# EAGLE design Mi2_v2 (EAGLE 7.2.0)
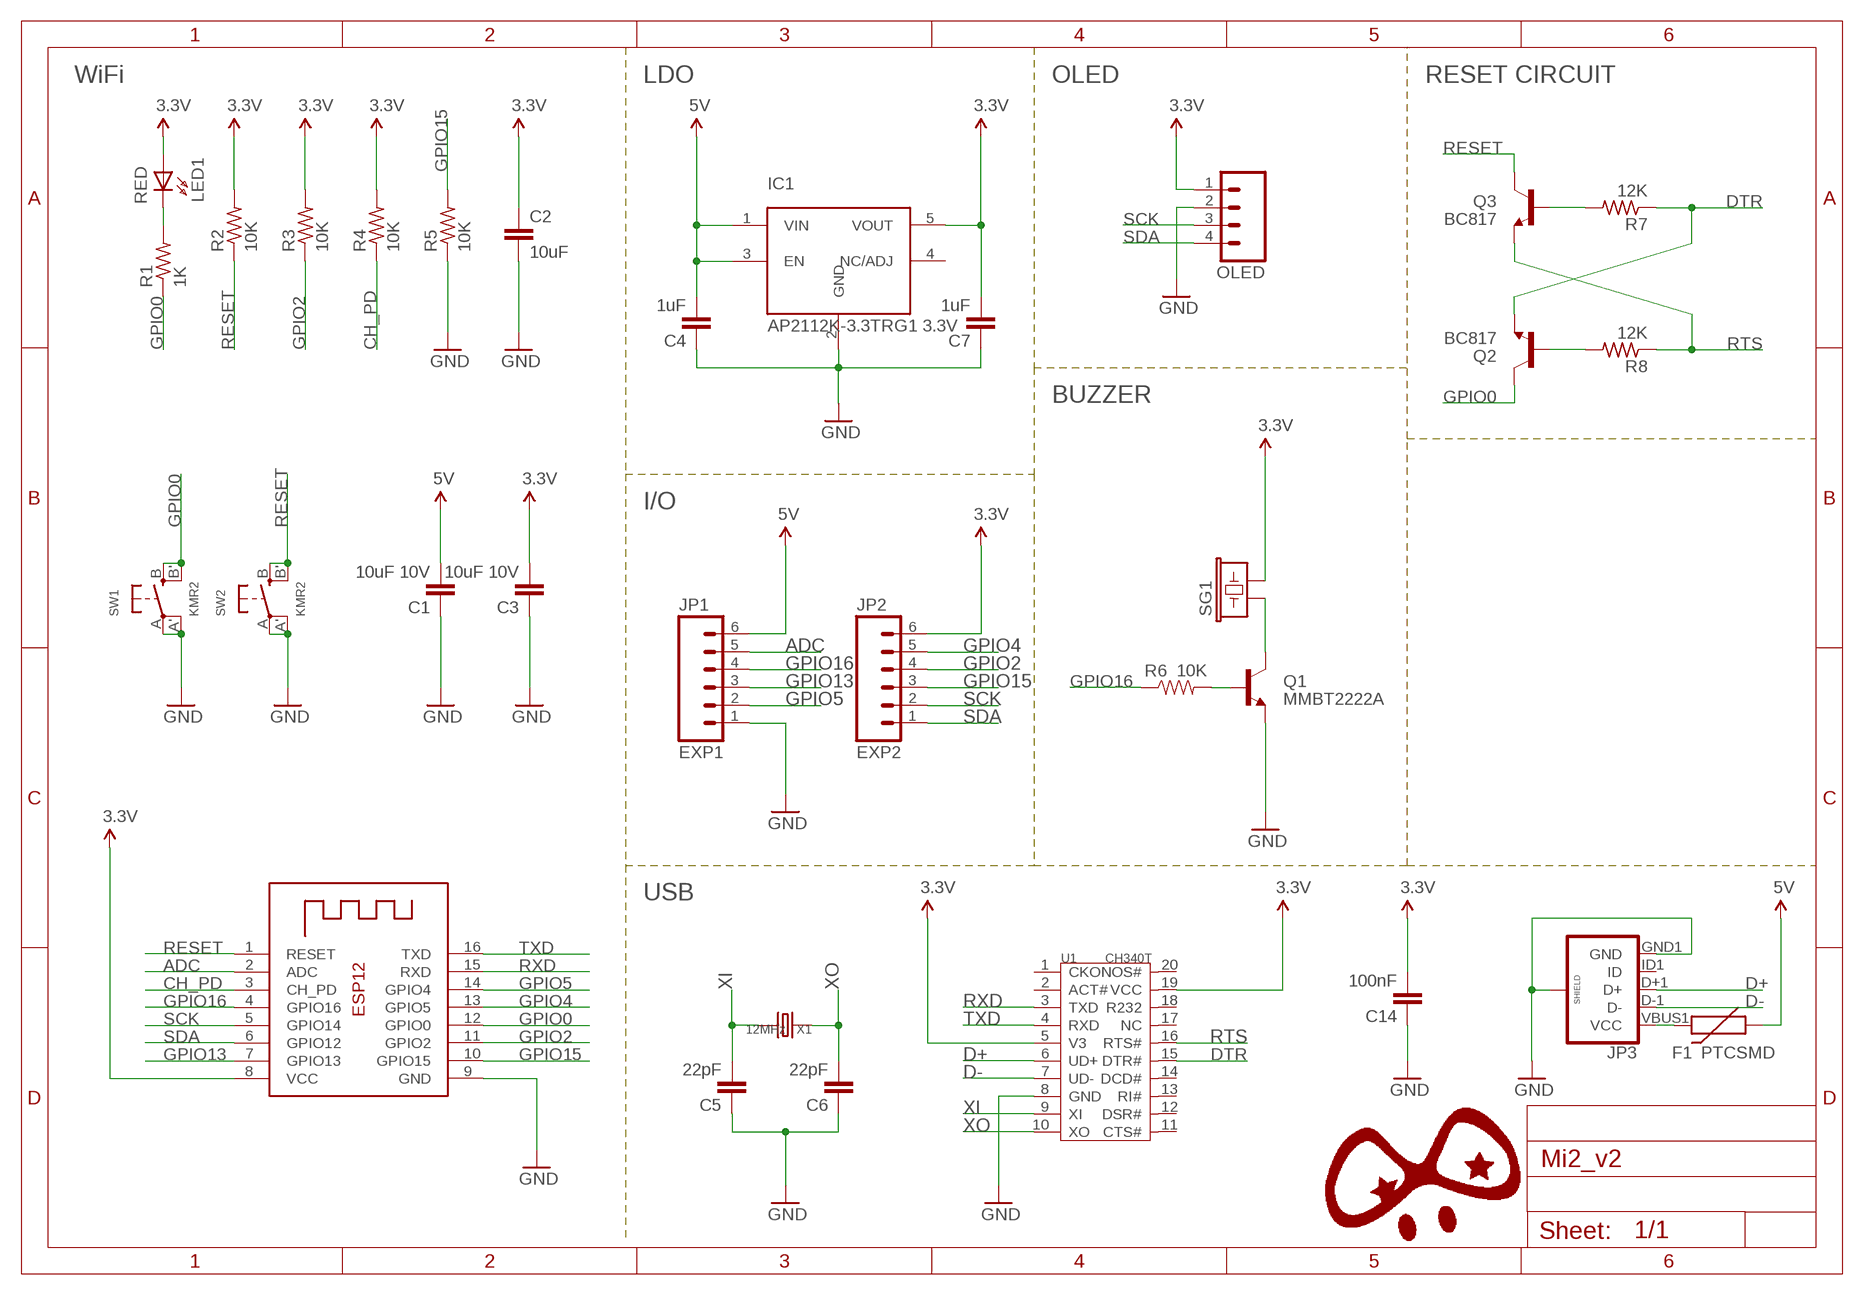
[diagram p0: schematic, sheet 1]

## Parts
C1  10uF 10V  CAP0402-CAP  [0402-CAP]
C2  10uF  10UF-6.3V-20%(0603)  [0603-CAP]
C3  10uF 10V  CAP0402-CAP  [0402-CAP]
C4  1uF  CAP0402-CAP  [0402-CAP]
C5  22pF  CAP0402-CAP  [0402-CAP]
C6  22pF  CAP0402-CAP  [0402-CAP]
C7  1uF  CAP0402-CAP  [0402-CAP]
C14  100nF  CAP0402-CAP  [0402-CAP]
F1  PTCSMD  [PTC-1206]
IC1  AP2112K-3.3TRG1 3.3V  5PIN_REG  [SOT23-5]
JP1  EXP1  M06LOCK  [1X06_LOCK]
JP2  EXP2  M06LOCK  [1X06_LOCK]
JP3  USB_MICROB_PLUGCONN-11752  [USB-B-MICRO-SMD_V03]
LED1  RED  LED0603DWS_L  [LED-0603_L]
OLED  M04LOCK  [1X04_LOCK]
Q1  MMBT2222A  TRANSISTOR_NPNMMBT2222A  [SOT23-3]
Q2  BC817  TRANSISTOR_NPNMMBT2222A  [SOT23-3]
Q3  BC817  TRANSISTOR_NPNMMBT2222A  [SOT23-3]
R1  1K  R-US_R0402  [R0402]
R2  10K  R-US_R0402  [R0402]
R3  10K  R-US_R0402  [R0402]
R4  10K  R-US_R0402  [R0402]
R5  10K  R-US_R0402  [R0402]
R6  10K  RESISTOR0402-RES  [0402-RES]
R7  12K  R-US_R0402  [R0402]
R8  12K  R-US_R0402  [R0402]
SG1  BUZZERSMD2  [BUZZER-CCV]
SW1  KMR2  SWITCH_TACT_SMT4.6X2.8  [BTN_KMR2_4.6X2.8]
SW2  KMR2  SWITCH_TACT_SMT4.6X2.8  [BTN_KMR2_4.6X2.8]
U1  CH340T  [SSOP20]
X1  12MHz  CRYSTAL'5032'  [2P-SMD-5X3.2]
X2  ESP-12  [ESP-12]

## Nets
3.3V: C2.1 C3.2 C7.2 C14.2 IC1.5(VOUT) JP2.6 LED1.A OLED.1 R2.2 R3.2 R4.2 SG1.- U1.5(V3) U1.19(VCC) X2.8(VCC)
5V: C1.2 C4.2 F1.1 IC1.1(VIN) IC1.3(EN) JP1.6
ADC: JP1.5 X2.2(ADC)
CH_PD: R4.1 X2.3(CH_PD)
D+: JP3.D+1(D+) U1.6(UD+)
D-: JP3.D-1(D-) U1.7(UD-)
DTR: Q2.2(E) R7.1 U1.15(DTR#)
GND: C1.1 C2.2 C3.1 C4.1 C5.1 C6.1 C7.1 C14.1 IC1.2(GND) JP1.1 JP3.GND1(GND) JP3.SHIELD1(SHIELD) JP3.SHIELD2(SHIELD) JP3.SHIELD3(SHIELD) OLED.2 Q1.2(E) R5.1 SW1.A'(P1) SW1.A(P) SW2.A'(P1) SW2.A(P) U1.8(GND) X2.9(GND)
GPIO0: Q2.3(C) R1.1 SW1.B'(S1) SW1.B(S) X2.12(GPIO0)
GPIO2: JP2.4 R3.1 X2.11(GPIO2)
GPIO4: JP2.5 X2.13(GPIO5)
GPIO5: JP1.2 X2.14(GPIO4)
GPIO13: JP1.3 X2.7(GPIO13)
GPIO15: JP2.3 R5.2 X2.10(GPIO15)
GPIO16: JP1.4 R6.1 X2.4(GPIO16)
N$1: Q3.1(B) R7.2
N$2: LED1.C R1.2
N$3: Q2.1(B) R8.2
N$7: Q1.3(C) SG1.+
N$8: Q1.1(B) R6.2
N$14: F1.2 JP3.VBUS1(VCC)
RESET: Q3.3(C) R2.1 SW2.B'(S1) SW2.B(S) X2.1(RESET)
RTS: Q3.2(E) R8.1 U1.16(RTS#)
RXD: U1.3(TXD) X2.15(RXD)
SCK: JP2.2 OLED.3 X2.5(GPIO14)
SDA: JP2.1 OLED.4 X2.6(GPIO12)
TXD: U1.4(RXD) X2.16(TXD)
XI: C5.2 U1.9(XI) X1.2
XO: C6.2 U1.10(XO) X1.1
Unconnected: IC1.4(NC/ADJ) JP3.ID1(ID) U1.1(CKO) U1.2(ACT#) U1.11(CTS#) U1.12(DSR#) U1.13(RI#) U1.14(DCD#) U1.17(NC) U1.18(R232) U1.20(NOS#)

## Notes on the sheet
- WiFi | LDO | OLED | RESET CIRCUIT
- BUZZER
- I/O
- USB

## Library data of the parts
C1 C3-C7 C14 = SparkFun-Passives:CAP: Capacitor Standard 0603 ceramic capacitor, and 0.1" leaded capacitor.
C2 = SparkFun-Capacitors:10UF-6.3V-20%(0603): CAP-11015; PROD_ID: CAP-11015
F1 = SparkFun-PowerIC:PTC: Resettable Fuse PTC Resettable Fuse. Spark Fun Electronics SKU : COM-08357; PROD_ID: RES-11150
IC1 = GHI:5PIN_REG
JP1 JP2 = SparkFun-Connectors:M06: Header 6 Standard 6-pin 0.1" header. Use with straight break away headers (SKU : PRT-00116), right angle break away headers (PRT-00553), swiss pins (PRT-00743), machine pins (PRT-00117), and female headers (PRT-00115). Molex polarized connector foot print use with SKU : PRT-08094 with associated crimp pins and housings. NOTES ON THE VARIANTS LOCK and LOCK_LONGPADS... This footprint was designed to help hold the alignment of a through-hole component (i.e. 6-pin header) while soldering it into place. You may notice that each hole has been shifted either up or down by 0.005 of an inch from it's more standard position (which is a perfectly straight line). This slight alteration caused the pins (the squares in the middle) to touch the edges of the holes. Because they are alternating, it causes a "brace" to hold the component in place. 0.005 has proven to be the perfect amount of "off-center" position when using our standard breakaway headers. Although looks a little odd when you look at the bare footprint, once you have a header in there, the alteration is very hard to notice. Also,if you push a header all the way into place, it is covered up entirely on the bottom side. This idea of altering the position of holes to aid alignment will be further integrated into the Sparkfun Library for other footprints. It can help hold any component with 3 or more connection pins.
JP3 = SparkFun-Connectors:USB_MICROB_PLUG: USB Micro-B connectors Some male, some female. Watch your step!; PROD_ID: CONN-11752
LED1 = DOUBLE-SIDE:LED
OLED = SparkFun-Connectors:M04: Header 4 Standard 4-pin 0.1" header. Use with straight break away headers (SKU : PRT-00116), right angle break away headers (PRT-00553), swiss pins (PRT-00743), machine pins (PRT-00117), and female headers (PRT-00115). Molex polarized connector foot print use with SKU : PRT-08231 with associated crimp pins and housings. 1MM SMD Version SKU: PRT-10208
Q1 = SparkFun-DiscreteSemi:TRANSISTOR_NPN: Generic NPN BJT MMBT2222A - TRANS-08049 (SOT-23, 1A 40V) MPSA42 - TRANS-09116 (SOT-23, 500mA 300V) MMBT5088LT1G - TRANS-11160 (SOT-23, 50 mA 30V) BC547 - COM-08928 <http://www.sparkfun.com/products/8928> (TO-92 45V 100mA) (1.Collector 2.Base 3.Emitter) 2N3904 - COM-00521 <http://www.sparkfun.com/products/521> (TO-92 40V 200mA) (1.Emitter 2.Base 3.Collector) P2N2222A - COM-12852 <http://www.sparkfun.com/products/12852> (TO-92 40V 600mA) (1.Collector 2.Base 3.Emitter); PROD_ID: TRANS-08049
Q2 Q3 = SparkFun-DiscreteSemi:TRANSISTOR_NPN: Generic NPN BJT MMBT2222A - TRANS-08049 (SOT-23, 1A 40V) MPSA42 - TRANS-09116 (SOT-23, 500mA 300V) MMBT5088LT1G - TRANS-11160 (SOT-23, 50 mA 30V) BC547 - COM-08928 <http://www.sparkfun.com/products/8928> (TO-92 45V 100mA) (1.Collector 2.Base 3.Emitter) 2N3904 - COM-00521 <http://www.sparkfun.com/products/521> (TO-92 40V 200mA) (1.Emitter 2.Base 3.Collector) P2N2222A - COM-12852 <http://www.sparkfun.com/products/12852> (TO-92 40V 600mA) (1.Collector 2.Base 3.Emitter); PROD_ID: TRANS-08049; VALUE: MMBT2222A
R1-R5 R7 R8 = resistor:R-US_: RESISTOR, American symbol
R6 = SparkFun:RESISTOR: Resistor Basic schematic elements and footprints for 0603, 1206, and PTH resistors.
SG1 = SparkFun-Electromechanical:BUZZER: Buzzer 12mm Spark Fun Electronics SKU : Comp-Buzzer
SW1 SW2 = microbuilder:SWITCH_TACT_SMT: SMT Tact Switches 6x6mm - Digikey: P12940SCT-ND KMR2 (4.6x2.8mm) - Digikey: 401-1426-1-ND EVQ-PQHB55 - Light Touch, 160GF (4.5x4.5mm) - Digikey: P8090SCT-ND KMT0 - KMT021 NGJ LHS (etc.) IP68/Waterproof - Digikey: CKN10289CT-ND
U1 = template:CH340T
X1 = Discrete:CRYSTAL*: CRYSTAL
X2 = microbuilder:ESP-12

## Net classes
0 default: width 0.254 mm, drill 0.254 mm, clearance 0.203 mm
2 pwr2: width 0.508 mm, clearance 0.205 mm

## Board
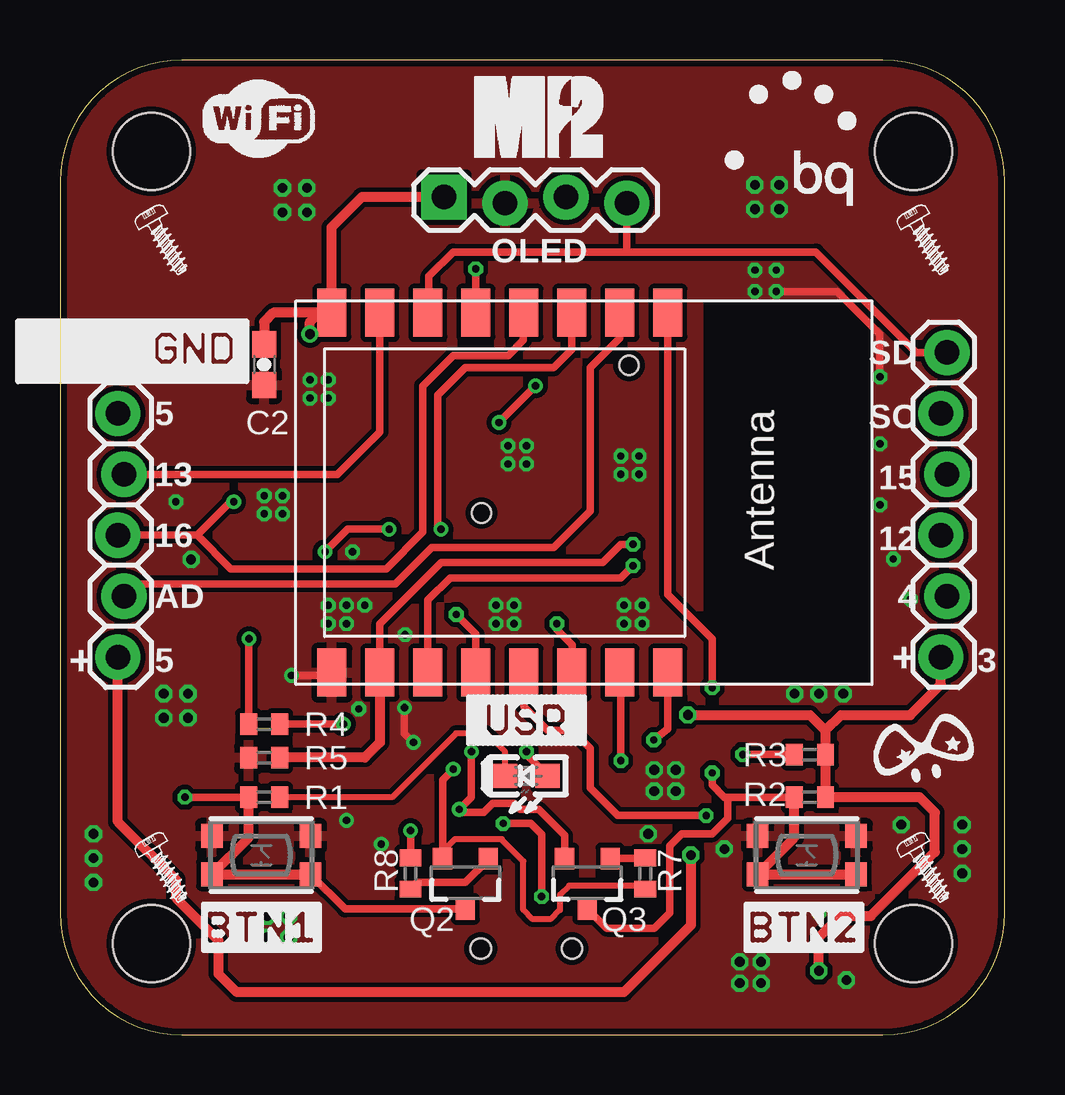
[diagram p1: board, top side]
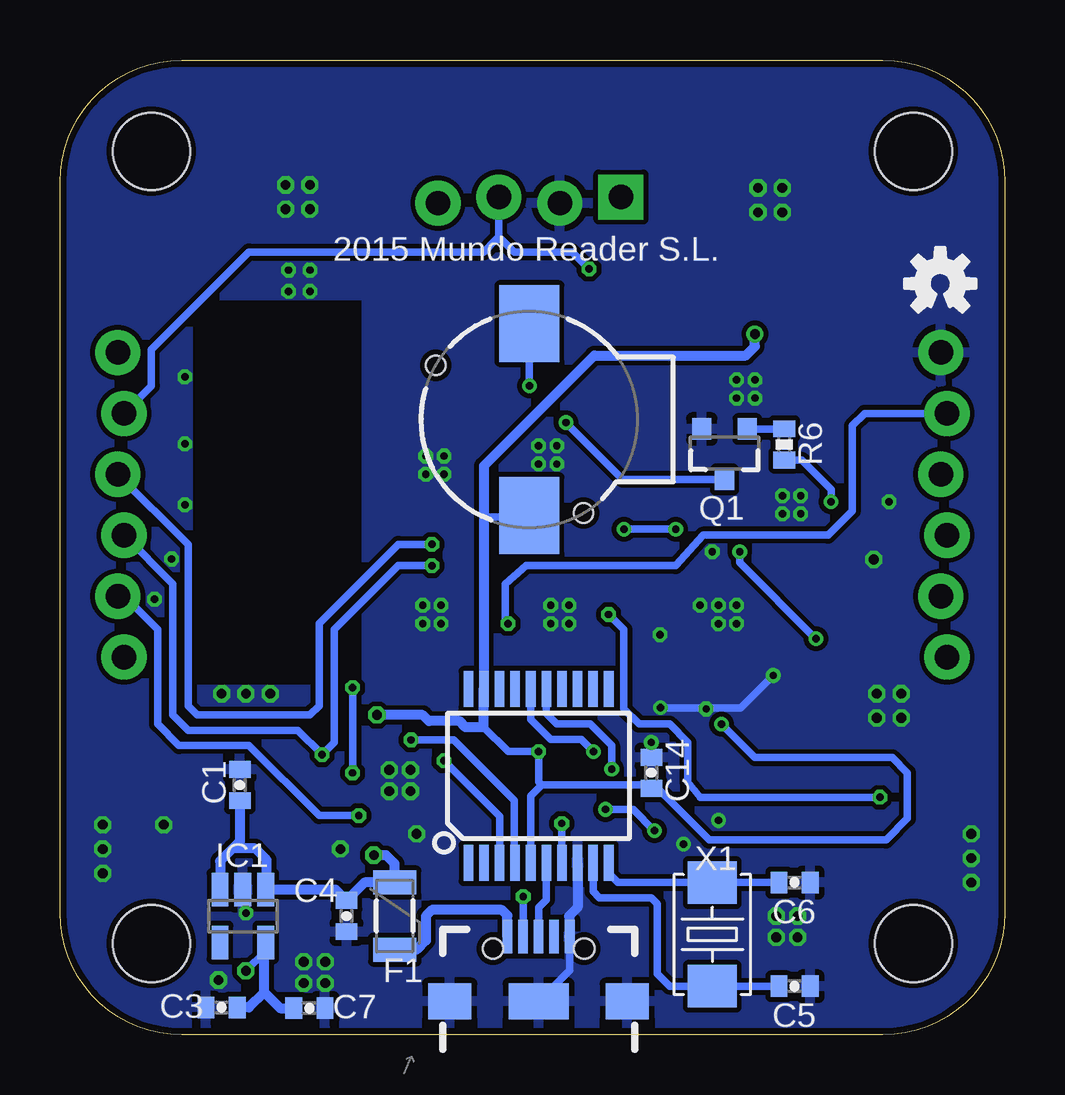
[diagram p2: board, bottom side, seen from below]

Size 39.37 x 40.64 mm. Coordinates in mm from the lower left corner, seen from the top.
Outline: 0,5.08 arc90 5.08,0 34.29,0 arc90 39.37,5.08 39.37,35.56 arc90 34.29,40.64 5.08,40.64 arc90 0,35.56 0,5.08
Copper layers (1*16): Top 0.035mm / dielectric 1.5mm / Bottom 0.035mm
Design rules "pighixxx_CAM_DRC_V1.0": minimum track width 6mil, minimum drill 12mil, track to track 6mil, track to pad 6mil, pad to pad 6mil, via to via 6mil, smd to smd 0mil, copper to edge 10mil, drill to drill 10mil, minimum pad ring 10mil, minimum via ring 6mil, stop-mask expansion 2mil, vias tented up to drill 100mil, thermal gap 10mil
Holes 3.2 mm at 3.81,36.83 35.56,36.83 35.56,3.81 3.81,3.81

### Footprints (pad centres in the part's own frame; a part is rotated, then mirrored left to right if it is on the bottom)
0402-CAP = smd 0.7 x 0.9: 1 -0.65,0; 2 0.65,0
0603-CAP = smd 1.1 x 1: 1 -0.85,0; 2 0.85,0
PTC-1206 = smd 1 x 1.8: 1 -1.4,0; 2 1.4,0
SOT23-5 = smd 0.7 x 1.4: 1 0.95,1.1; 2 0,1.1; 3 -0.95,1.1; 4 -0.95,-1.1; 5 0.95,-1.1
1X06_LOCK = drill 1.016 pad 1.88: 1 0,0; 2 2.54,-0.254; 3 5.08,0; 4 7.62,-0.254; 5 10.16,0; 6 12.7,-0.254
USB-B-MICRO-SMD_V03 = smd 1.4 x 0.4: D+1 2.7,0; D-1 2.7,0.65; GND1 2.7,-1.3; ID1 2.7,-0.65; VBUS1 2.7,1.3 | smd 1.5 x 1.8: SHIELD1 0,3.7; SHIELD2 0,-3.7 | smd 1.5 x 2.5: SHIELD3 0,0 | hole 0.85: 2.2,1.9; 2.2,-1.9
LED-0603_L = smd 1.016 x 1.016: A 0.889,0; C -0.889,0
1X04_LOCK = drill 1.016 pad 1.88 square: 1 0,0.127 | drill 1.016 pad 1.88: 2 2.54,-0.127; 3 5.08,0.127; 4 7.62,-0.127
SOT23-3 = smd 0.8 x 0.9: 1 -0.95,-1; 2 0.95,-1; 3 0,1.1
R0402 = smd 0.7 x 0.9: 1 -0.65,0; 2 0.65,0
0402-RES = smd 0.7 x 0.9: 1 -0.65,0; 2 0.65,0
BUZZER-CCV = smd 3.2 x 2.5: + 4,0; - -4,0 | hole 0.8: -3.9,-2.25; 2.25,3.9
BTN_KMR2_4.6X2.8 = smd 0.9 x 1: A 2.05,0.8; A' -2.05,0.8; B 2.05,-0.8; B' -2.05,-0.8
SSOP20 = smd 0.4 x 1.5: 1 -2.925,-3.625; 2 -2.275,-3.625; 3 -1.625,-3.625; 4 -0.975,-3.625; 5 -0.325,-3.625; 6 0.325,-3.625; 7 0.975,-3.625; 8 1.625,-3.625; 9 2.275,-3.625; 10 2.925,-3.625; 11 2.925,3.625; 12 2.275,3.625; 13 1.625,3.625; 14 0.975,3.625; 15 0.325,3.625; 16 -0.325,3.625; 17 -0.975,3.625; 18 -1.625,3.625; 19 -2.275,3.625; 20 -2.925,3.625
2P-SMD-5X3.2 = smd 1.778 x 2.032: 1 -2.159,0; 2 2.159,0
ESP-12 = smd 2 x 1.2: 1 -7.5,4.5; 2 -7.5,2.5; 3 -7.5,0.5; 4 -7.5,-1.5; 5 -7.5,-3.5; 6 -7.5,-5.5; 7 -7.5,-7.5; 8 -7.5,-9.5; 9 7.5,-9.5; 10 7.5,-7.5; 11 7.5,-5.5; 12 7.5,-3.5; 13 7.5,-1.5; 14 7.5,0.5; 15 7.5,2.5; 16 7.5,4.5

### Placement (x,y rotation side)
C1  31.88,10.41 270 bottom
C2  8.51,27.94 270 top
C3  32.64,1.14 0 bottom
C4  27.43,4.95 90 bottom
C5  8.76,2.03 180 bottom
C6  8.76,6.35 180 bottom
C7  28.98,1.12 180 bottom
C14  14.73,10.92 270 bottom
F1  25.43,4.95 270 bottom
IC1  31.75,4.95 0 bottom
JP1  2.67,28.45 270 top
JP2  36.96,28.45 270 top
JP3  19.43,1.4 90 bottom
LED1  19.43,10.79 0 top
LOGO1  OSHW-LOGOS  [OSHW-LOGO-S]  2.69,31.32 0 bottom
OLED  16,34.8 0 top
Q1  11.68,24.26 180 bottom
Q2  16.89,6.35 180 top
Q3  21.97,6.35 180 top
R1  8.51,9.91 0 top
R2  31.24,9.91 0 top
R3  31.24,11.68 0 top
R4  8.51,12.95 0 top
R5  8.51,11.56 0 top
R6  9.19,24.61 90 bottom
R7  24.38,6.73 90 top
R8  14.61,6.73 270 top
SG1  19.81,25.65 90 bottom
SW1  8.38,7.49 0 top
SW2  31.11,7.49 0 top
U1  19.43,10.79 0 bottom
U$1  [PIGHIXXX_LOGO]  33.91,10.54 0 top
U$2  [S_KICIK_GND_1]  -2.03,26.92 0 top
U$3  [S_WIFI]  5.97,36.58 0 top
U$4  [S_BTN1]  5.97,5.46 270 top
U$5  [S_BTN2]  28.57,5.46 270 top
U$6  [S_USR]  17.02,14.1 270 top
U$7  [BQ_LOGO_SMALL]  27.71,34.57 0 top
U$8  [SCREW]  3.81,32.51 0 top
U$9  [SCREW]  35.56,32.51 0 top
U$10  [SCREW]  35.56,6.35 0 top
U$11  [SCREW]  3.81,6.35 0 top
U$12  [MI2_LOGO]  17.27,36.58 0 top
X1  12.19,4.19 270 bottom
X2  20.83,22.61 270 top

### Tracks (layer width: path | path; a pad name or v marks a point on that pad's centre or on a via)
3.3V  (via drill 0.3, 0.41)
  Top 0.305: X2.8 10.79,30.1 | 31.88,11.7 R3.2 | R4.2 v11.81,12.95 | LED1.A 19.43,11.68 v19.43,11.81
  Top 0.356: X2.8 11.33,29.44
  Top 0.406: C2.1 8.51,29.72 8.89,30.1 10.79,30.1 10.41,29.72 v10.41,29.21 | v26.16,13.34 31.24,13.34 31.89,12.69 | v31.62,2.67 31.62,4.06 32.51,4.95 33.78,4.95 36.45,7.62 36.45,9.27 35.81,9.91 R2.2 R3.2 31.89,12.69 | OLED.1 12.57,34.92 11.3,33.66 11.3,30.13 X2.8 | 31.89,12.69 32.54,13.34 35.43,13.34 36.7,14.61 JP2.6
  Bottom 0.305: U1.5 19.76,9.96 19.3,10.41 | 19.3,10.41 14.87,10.41 C14.2 14.46,10.27 12.32,8.13 4.95,8.13 4.06,9.02 4.06,10.92 4.7,11.56 10.41,11.56 v11.81,12.95 | 29.66,1.4 C7.2 | 30.86,3.79 IC1.5 30.8,3.49 v31.62,2.67 | 19.3,10.41 19.43,10.54 v19.43,11.81 20.7,11.81 21.72,12.83 21.71,12.84 U1.19 | SG1.- 19.88,21.59 21.71,21.59
  Bottom 0.406: 30.86,1.78 30.86,3.79 | 30.86,1.78 31.5,1.14 C3.2 | 30.86,1.78 30.2,1.12 C7.2 | U1.19 21.72,12.83 22.48,12.83 22.73,13.08 24,13.08 24.26,13.34 v26.16,13.34 | v10.41,29.21 10.41,28.7 10.79,28.32 17.11,28.32 21.71,23.72 21.71,21.59 U1.19
5V  (via drill 0.41)
  Top 0.406: v26.29,7.49 26.29,4.57 23.5,1.78 7.37,1.78 6.6,2.54 6.6,3.94 4.83,5.71 4.83,6.48 2.41,8.89 JP1.6
  Bottom 0.406: 32.18,7.77 31.24,7.77 30.76,7.29 30.76,6.09 IC1.1 27.88,6.05 C4.2 26.68,6.35 F1.1 25.43,7.14 25.78,7.49 v26.29,7.49 | 32.18,7.77 32.7,7.25 IC1.3 | C1.2 31.88,8.08 32.18,7.77
ADC
  Top 0.305: JP1.5 3.17,18.8 13.97,18.8 15.49,20.32 20.57,20.32 22.1,21.84 22.1,27.81 23.33,29.04 X2.2
CH_PD  (via drill 0.3)
  Top 0.305: v7.87,16.51 7.87,12.97 R4.1 | 21.34,30.1 X2.3 21.33,28.57 20.57,27.81 16.89,27.81 15.75,26.67 15.75,21.21 v15.88,21.08 | v11.05,20.14 11.99,21.08 v13.72,21.08
  Bottom 0.305: v15.88,21.08 v13.72,21.08 | v11.05,20.14 11.05,19.68 v7.87,16.51
D+
  Bottom 0.305: U1.6 19.1,5.64 19.43,5.31 JP3.D+1
  Bottom 0.356: U1.6
D-  (via drill 0.3)
  Top 0.305: v18.47,8.81 19.61,8.81 20.07,8.36 v20.07,5.77
  Bottom 0.305: U1.7 v18.47,8.81 | v20.07,5.77 20.07,4.11 JP3.D-1
  Bottom 0.356: U1.7
DTR  (via drill 0.3)
  Top 0.254: 24.24,6.22 21.21,6.22 20.83,5.84 20.83,5.21 20.45,4.83 19.68,4.83 19.3,5.21 19.3,7.24 18.41,8.13 18.41,8.15 16.45,8.15 15.94,7.64 Q2.2
  Top 0.305: Q2.2 15.94,10.63 v16.38,11.07 | R7.1 24.24,6.22
  Bottom 0.305: U1.15 19.11,13.39 18.67,12.95 17.27,12.95 16.38,12.06 v16.38,11.07
GND  (via drill 0.3, 0.41)
  Top 0.305: v29.84,30.99 32.38,30.99 34.16,29.21 v34.16,27.43 | v14.73,12.19 14.35,12.57 v14.35,13.64 | 11.21,14.99 arc90 X2.9 arc-90 11.21,14.99 | v9.65,14.99 11.21,14.99
  Bottom 0.305: JP3.GND1 18.13,2.7 JP3.SHIELD3 | C14.1 v14.73,12.19 | v14.35,13.64 11,13.64 v9.65,14.99
  Bottom 0.406: U1.8 17.81,5.31 18.16,4.95 18.16,4.13 JP3.GND1
  other vias: 27.69,7.75 28.32,3.05 32.77,2.29 28.32,2.16 28.96,30.99 34.16,24.64 34.16,22.1 34.72,19.84 35.43,18.16 29.21,2.16 35.05,8.76 37.59,8.76 37.59,7.75 37.59,6.73 25.65,11.05 24.51,8.38 31.62,5.08 4.32,14.22 5.33,14.22 5.33,13.21 1.4,8.38 1.4,7.37 1.4,6.35 5.46,19.81 8.51,22.48 8.51,21.72 29.84,31.88 28.96,31.88 30.61,14.22 31.62,14.22 32.64,14.22 9.27,35.31 10.29,35.31 10.29,34.29 9.27,34.29 29.97,35.43 29.97,34.42 28.96,34.42 28.96,35.43 4.32,13.21 24.13,24.13 18.16,17.14 23.5,17.14 12.7,17.91 11.94,17.91 11.18,17.91 14.38,16.69 12.19,20.14 4.83,22.23 11.94,8.94 13.39,7.95 12.45,13.59 19.43,24.56 18.67,23.8 23.37,24.13 23.37,23.37 24.13,23.37 9.27,22.48 9.27,21.72 11.94,17.14 11.18,17.14 24.77,11.05 25.65,10.16 24.77,10.16 18.92,17.14 18.92,17.91 18.16,17.91 23.5,17.91 24.26,17.14 24.26,17.91 10.41,27.3 11.18,27.3 11.18,26.54 10.41,26.54 18.67,24.56 19.43,23.8 29.21,3.05 9.53,4.06 9.53,4.95 8.64,4.95 8.64,4.06
  pour Top: -0.76,33.27 -0.76,-0.64 20.57,-0.64 40.13,-0.64 40.13,40.77 -0.76,40.77 -0.76,33.53
  pour Bottom: -0.64,38.48 -0.64,-0.64 40.13,-0.64 40.13,40.89 14.1,40.89 -0.64,40.89 -0.64,38.73
GPIO0  (via drill 0.3)
  Top 0.305: v16.51,17.53 17.33,16.71 X2.12 | v5.21,9.91 R1.1 | Q2.3 11.88,5.25 SW1.B
  Top 0.406: SW1.B SW1.B' 7.86,8.22 R1.1
  Bottom 0.305: v5.21,9.91 12.7,9.91 13.21,10.54 13.21,12.19 13.97,12.95 15.24,12.95 15.88,13.59 15.88,16.89 v16.51,17.53
GPIO2  (via drill 0.3)
  Top 0.305: X2.11 15.33,18.12 16.26,19.05 23.37,19.05 v23.88,19.56 | v28.45,11.68 R3.1
  Bottom 0.305: v23.88,19.56 25.27,19.56 27.94,16.89 27.94,12.19 v28.45,11.68 29.46,12.7 34.04,12.7 34.67,13.34 34.67,18.8 JP2.4
GPIO4  (via drill 0.3)
  Top 0.305: X2.13 19.33,13.69 20.32,12.7 21.34,12.7 22.1,11.94 22.1,10.29 23.24,9.14 v26.92,9.14
  Bottom 0.305: v26.92,9.14 28.57,9.14 31.5,12.06 34.42,12.06 35.31,12.95 35.31,16.89 36.7,18.29 JP2.5
GPIO5  (via drill 0.3)
  Top 0.305: v20.7,17.14 20.7,16.89 21.34,16.26 X2.14
  Bottom 0.305: JP1.2 5.84,25.91 6.35,25.4 6.35,21.84 7.37,20.83 12.57,20.83 13.72,19.56 19.94,19.56 20.83,18.8 20.83,17.27 v20.7,17.14
GPIO13
  Top 0.305: X2.7 13.33,25.14 11.56,23.37 JP1.3
GPIO15  (via drill 0.3)
  Top 0.305: X2.10 13.33,17.14 15.88,19.68 22.61,19.68 23.37,20.45 v23.88,20.45
  Top 0.406: X2.10 13.33,12.19 12.7,11.56 R5.2
  Bottom 0.305: JP2.3 34.04,20.45 34.04,13.72 33.66,13.34 28.96,13.34 28.57,13.72 28.57,17.14 25.27,20.45 v23.88,20.45
GPIO16  (via drill 0.3)
  Top 0.305: 5.71,20.83 7.11,19.43 13.59,19.43 15.11,20.95 15.11,27.05 16.38,28.32 18.67,28.32 19.3,28.96 19.3,30.08 X2.4 | 5.71,20.83 JP1.4 | v7.24,22.23 7.11,22.23 5.71,20.83
  Bottom 0.305: R6.1 8.47,23.96 7.24,22.73 v7.24,22.23
N$1
  Top 0.305: R7.2 24.35,7.35 Q3.1
N$2
  Top 0.254: LED1.C 18.54,11.81 17.78,12.57 16.51,12.57 13.84,9.91 R1.2
N$3
  Top 0.305: R8.2 14.87,6.35 16.89,6.35 17.84,7.3 Q2.1
N$7  (via drill 0.3)
  Top 0.305: v18.29,25.53 v19.81,27.05
  Bottom 0.305: Q1.3 15.92,23.16 v18.29,25.53 | v19.81,27.05 SG1.+
N$8
  Bottom 0.305: R6.2 Q1.1
N$14
  Bottom 0.406: JP3.VBUS1 20.73,4.98 20.95,5.21 23.88,5.21 24.13,4.95 24.13,3.94 24.51,3.56 F1.2
RESET  (via drill 0.3)
  Top 0.305: X2.1 25.33,18.36 27.18,16.51 v27.18,14.48 | R2.1 27.81,9.91 | 27.81,9.91 27.69,9.91 27.18,10.41 v27.18,10.92 | Q3.3 22.78,4.45 24.77,4.45 25.4,5.08 25.4,7.87 25.91,8.38 27.18,8.38 27.81,9.02 27.81,9.91
  Top 0.406: SW2.B SW2.B' 30.59,8.22 R2.1
  Bottom 0.305: v27.18,14.48 v27.18,10.92
RTS  (via drill 0.3)
  Top 0.305: v17.14,11.81 17.14,9.91 v16.64,9.4 16.76,9.27 17.65,9.27 18.03,9.65 18.92,9.65 19.18,9.4 19.94,9.4 21.02,8.32 Q3.2 | v14.61,8.51 R8.1
  Bottom 0.305: U1.16 19.76,13.15 18.92,12.32 17.65,12.32 v17.14,11.81 | v16.64,9.4 15.49,9.4 v14.61,8.51
RXD  (via drill 0.3)
  Top 0.305: X2.15 23.37,15.07 v23.37,11.43
  Bottom 0.305: v23.37,11.43 21.06,9.12 U1.3
SCK  (via drill 0.3)
  Top 0.305: X2.5 v17.33,31.92 v17.32,31.93
  Bottom 0.305: JP2.2 35.56,27.05 35.56,28.57 31.5,32.64 21.72,32.64 21.21,33.15 | 21.21,33.15 21.08,33.27 OLED.3 | v17.32,31.93 18.03,32.64 20.45,32.64 20.95,33.15 21.21,33.15
SDA
  Top 0.305: X2.6 15.37,30.14 15.37,31.62 16.38,32.64 23.62,32.64 | 23.62,32.64 31.5,32.64 35.69,28.45 JP2.1 | OLED.4 23.62,32.64
TXD  (via drill 0.3)
  Top 0.305: v24.74,12.29 25.33,12.76 X2.16
  Bottom 0.305: v24.74,12.29 22.96,12.29 20.45,9.78 20.45,7.21 U1.4
XI
  Bottom 0.305: U1.9 17.16,5.98 16.89,5.71 14.73,5.71 14.48,5.46 14.48,2.54 13.97,2.03 X1.2 C5.2
XO
  Bottom 0.305: U1.10 16.51,6.73 16.13,6.35 X1.1 C6.2

### Text on the board
tNames: SD | 5 | SC | 13 | 15 | 16 | 12 | AD | 4 | + | 5 | + | 3
bNames: 2015 Mundo Reader S.L.